# Altium project CNCMicaMini.PrjPcb
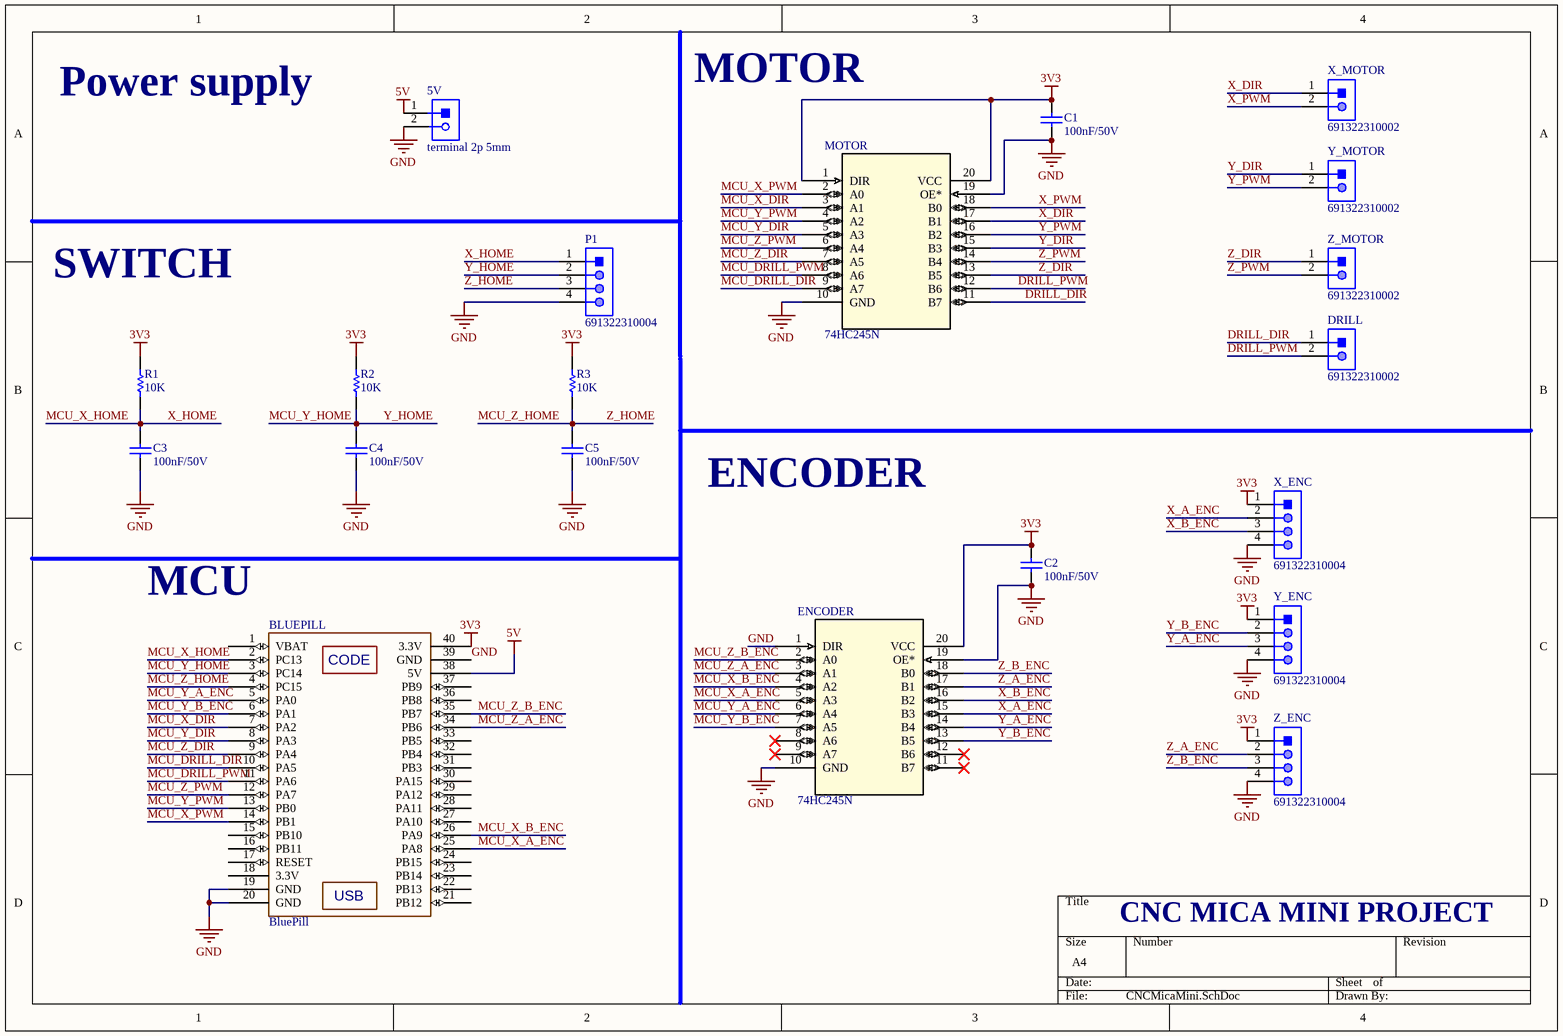
[diagram p0: CNCMicaMini.SchDoc]
1 sheet, 20 parts. Net scope: global (net labels, ports and power ports of the same name join across sheets).
Board files: CNCMicaMini_Pre.PcbDoc, CNCMicaMini.PcbDoc

## Sheet CNCMicaMini.SchDoc
size A4; SheetNumber: 1; SheetTotal: 1

### Parts
5V  terminal 2p 5mm  [terminal 2p 5mm]
BLUEPILL  BluePill  [BlUEPILL]
C1  value 100nF/50V  [CAP-SM-0805]  (hidden comment: Cap-100nF-50V-0805)
C2  value 100nF/50V  [CAP-SM-0805]  (hidden comment: Cap-100nF-50V-0805)
C3  value 100nF/50V  [CAP-SM-0805]  (hidden comment: Cap-100nF-50V-0805)
C4  value 100nF/50V  [CAP-SM-0805]  (hidden comment: Cap-100nF-50V-0805)
C5  value 100nF/50V  [CAP-SM-0805]  (hidden comment: Cap-100nF-50V-0805)
DRILL  691322310002  [691322310002]
ENCODER  74HC245N  [74HC245N]
MOTOR  74HC245N  [74HC245N]
P1  691322310004  [691322310004]
R1  value 10K  [RES-SM-0805]  (hidden comment: Res-10k-0805)
R2  value 10K  [RES-SM-0805]  (hidden comment: Res-10k-0805)
R3  value 10K  [RES-SM-0805]  (hidden comment: Res-10k-0805)
X_ENC  691322310004  [691322310004]
X_MOTOR  691322310002  [691322310002]
Y_ENC  691322310004  [691322310004]
Y_MOTOR  691322310002  [691322310002]
Z_ENC  691322310004  [691322310004]
Z_MOTOR  691322310002  [691322310002]

### Nets
3V3: BLUEPILL.40(3.3V) C1.2 C2.2 ENCODER.20(VCC) MOTOR.1(DIR) MOTOR.20(VCC) R1.2 R2.2 R3.2 X_ENC.1 Y_ENC.1 Z_ENC.1
5V: 5V.1 BLUEPILL.38(5V)
GND: 5V.2 BLUEPILL.19(GND) BLUEPILL.20(GND) BLUEPILL.39(GND) C1.1 C2.1 C3.1 C4.1 C5.1 ENCODER.1(DIR) ENCODER.10(GND) ENCODER.19(OE*) MOTOR.10(GND) MOTOR.19(OE*) P1.4 X_ENC.4 Y_ENC.4 Z_ENC.4
DRILL_DIR: DRILL.1 MOTOR.11(B7)
DRILL_PWM: DRILL.2 MOTOR.12(B6)
MCU_DRILL_DIR: BLUEPILL.10(PA5) MOTOR.9(A7)
MCU_DRILL_PWM: BLUEPILL.11(PA6) MOTOR.8(A6)
MCU_X_A_ENC: BLUEPILL.25(PA8) ENCODER.5(A3)
MCU_X_B_ENC: BLUEPILL.26(PA9) ENCODER.4(A2)
MCU_X_DIR: BLUEPILL.7(PA2) MOTOR.3(A1)
MCU_X_HOME: BLUEPILL.2(PC13) C3.2 P1.1 R1.1  [also labelled X_HOME]
MCU_X_PWM: BLUEPILL.14(PB1) MOTOR.2(A0)
MCU_Y_A_ENC: BLUEPILL.5(PA0) ENCODER.6(A4)
MCU_Y_B_ENC: BLUEPILL.6(PA1) ENCODER.7(A5)
MCU_Y_DIR: BLUEPILL.8(PA3) MOTOR.5(A3)
MCU_Y_HOME: BLUEPILL.3(PC14) C4.2 P1.2 R2.1  [also labelled Y_HOME]
MCU_Y_PWM: BLUEPILL.13(PB0) MOTOR.4(A2)
MCU_Z_A_ENC: BLUEPILL.34(PB6) ENCODER.3(A1)
MCU_Z_B_ENC: BLUEPILL.35(PB7) ENCODER.2(A0)
MCU_Z_DIR: BLUEPILL.9(PA4) MOTOR.7(A5)
MCU_Z_HOME: BLUEPILL.4(PC15) C5.2 P1.3 R3.1  [also labelled Z_HOME]
MCU_Z_PWM: BLUEPILL.12(PA7) MOTOR.6(A4)
X_A_ENC: ENCODER.15(B3) X_ENC.2
X_B_ENC: ENCODER.16(B2) X_ENC.3
X_DIR: MOTOR.17(B1) X_MOTOR.1
X_PWM: MOTOR.18(B0) X_MOTOR.2
Y_A_ENC: ENCODER.14(B4) Y_ENC.3
Y_B_ENC: ENCODER.13(B5) Y_ENC.2
Y_DIR: MOTOR.15(B3) Y_MOTOR.1
Y_PWM: MOTOR.16(B2) Y_MOTOR.2
Z_A_ENC: ENCODER.17(B1) Z_ENC.2
Z_B_ENC: ENCODER.18(B0) Z_ENC.3
Z_DIR: MOTOR.13(B5) Z_MOTOR.1
Z_PWM: MOTOR.14(B4) Z_MOTOR.2

Not connected (* = marked no-connect by the designer): BLUEPILL 1(VBAT) 15(PB10) 16(PB11) 17(RESET) 18(3.3V) 21(PB12) 22(PB13) 23(PB14) 24(PB15) 27(PA10) 28(PA11) 29(PA12) 30(PA15) 31(PB3) 32(PB4) 33(PB5) 36(PB8) 37(PB9); ENCODER 8(A6)* 9(A7)* 11(B7)* 12(B6)*

### Notes on the sheet
- Power supply
- MOTOR
- SWITCH
- ENCODER
- MCU
- CNC MICA MINI PROJECT
- (in symbol BluePill) CODE; USB

### Library data of the parts
C1-C5 = Cap-100nF-50V-0805: CAP CER 0.1UF 50V Y5V 0805; Manufacturer: Samsung Electro-Mechanics; Manufacturer Part Number: CL21F104ZBCNNNC; Local Supplier: thegioiic; Local Supplier Link: https://www.thegioiic.com/products/tu-gom-0805-100nf-0-1uf-50v; Supplier 1: Digikey; Supplier 1 Part Number: 1276-1007-1-ND; Supplier 1 Link: https://www.digikey.com/product-detail/en/samsung-electro-mechanics/CL21F104ZBCNNNC/1276-1007-1-ND/3889093
DRILL X_MOTOR Y_MOTOR Z_MOTOR = 691322310002: WR-TBL Serie 322 Horizontal PCB Header, Pluggable, pitch 3.81mm, 2p; Compliance: RoHS; Modularity: No; Pin Number: 2; Rated Current [UL]: 10A; Working Voltage [UL]: 300VAC; ComponentLink1Description: Manufacturer; ComponentLink1URL: http://www.we-online.de; ComponentLink2URL: https://katalog.we-online.de/em/datasheet/691322310002.pdf; ComponentLink2Description: Datasheet; Mounting Technology: THT; Part Number: 691322310002; Packaging: Box; Operating Temperature: -40 to +105degC; PCB/Cable/Panel: PCB; Pitch: 3.81mm; Published Date: October 2019; Type: Horizontal; Publisher: Wurth Elektronik; Application: Pluggable
ENCODER MOTOR = 74HC245N: No Description Available; Mfr_Name: NXP; Copyright: Copyright (C) 2022 Ultra Librarian. All rights reserved.; Manufacturer_Part_Number: 74HC245N; RefDes: RefDes; Type: DEV
P1 X_ENC Y_ENC Z_ENC = 691322310004: WR-TBL Serie 322 Horizontal PCB Header, Pluggable, pitch 3.81mm, 4p; Compliance: RoHS; Modularity: No; Pin Number: 4; Rated Current [UL]: 10A; Working Voltage [UL]: 300VAC; ComponentLink1Description: Manufacturer; ComponentLink1URL: http://www.we-online.de; ComponentLink2URL: https://katalog.we-online.de/em/datasheet/691322310004.pdf; ComponentLink2Description: Datasheet; Mounting Technology: THT; Part Number: 691322310004; Packaging: Box; Operating Temperature: -40 to +105degC; PCB/Cable/Panel: PCB; Pitch: 3.81mm; Published Date: October 2019; Type: Horizontal; Publisher: Wurth Elektronik; Application: Pluggable
R1-R3 = Res-10k-0805: RES 10K OHM 1% 1/4W 0805; Manufacturer: Stackpole Electronics Inc; Manufacturer Part Number: RNCP0805FTD10K0; Local Supplier: thegioiic; Local Supplier Link: https://www.thegioiic.com/products/dien-tro-10-kohm-0805-5; Supplier 1: Digikey; Supplier 1 Link: https://www.digikey.com/product-detail/en/stackpole-electronics-inc/RNCP0805FTD10K0/RNCP0805FTD10K0CT-ND/2240601; Supplier 1 Part Number: RNCP0805FTD10K0CT-ND